# EAGLE schematic nRF_prog_vusb_3V3 (EAGLE 6.4)
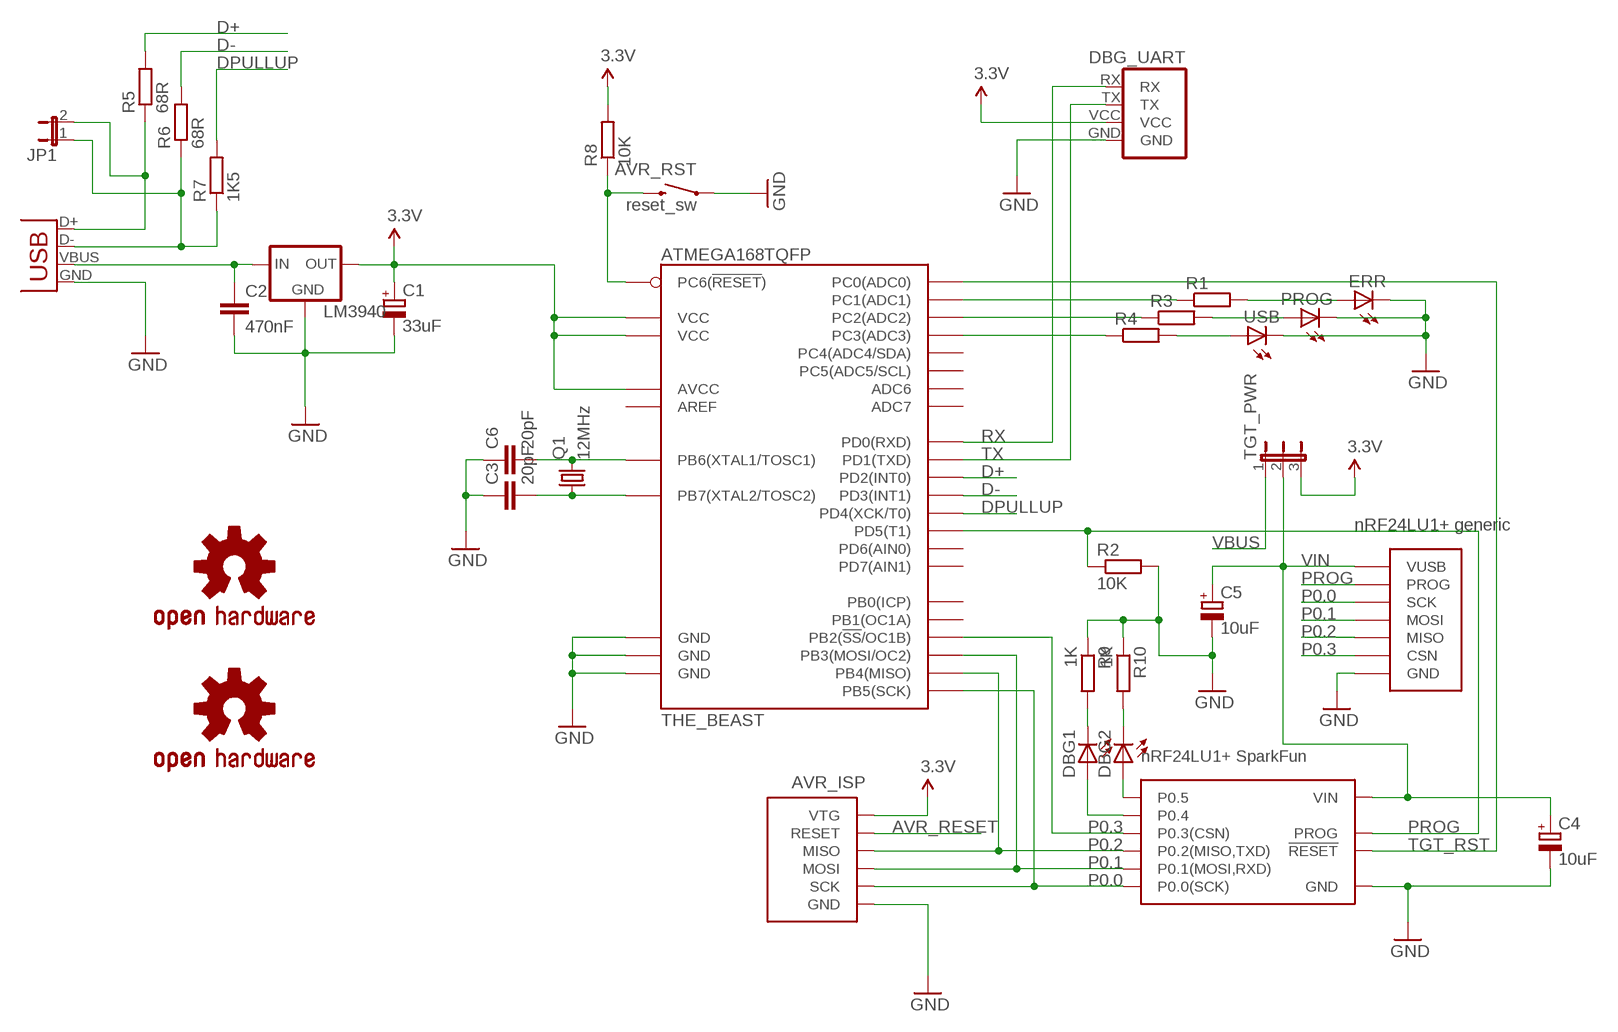
[diagram p0: schematic, sheet 1]

## Parts
AVR_ISP  AVR-ISP-6SMALL_FP  [AVR-ISP-6-SMALL-FP]
AVR_RST  reset_sw  SWITCH-MOMENTARY-2SMD  [TACTILE_SWITCH_SMD]
C1  33uF  CPOL-EUSMCB  [SMC_B]
C2  470nF  C-EUC0805K  [C0805K]
C3  20pF  C-EUC0805  [C0805]
C4  10uF  CPOL-EUSMCB  [SMC_B]
C5  10uF  CPOL-EUSMCB  [SMC_B]
C6  20pF  C-EUC0805  [C0805]
DBG1  LEDCHIPLED_0805  [CHIPLED_0805]
DBG2  LEDCHIPLED_0805  [CHIPLED_0805]
DBG_UART  UART_PORT  [UART_PORT]
ERR  LEDCHIPLED_0805  [CHIPLED_0805]
JP1  JP1E  [JP1]
LM3940  LM3940  [SOT223]
LU1+_GENERIC  NRF24LU1P_GENERIC  [NRF24LU1P_GENERIC]
LU1+_SPARKFUN  NRF24LU1P_SPARKFUN_BREAKOUT  [NRF24LU+_SPARKFUN_BREAKOUT]
PROG  LEDCHIPLED_0805  [CHIPLED_0805]
Q1  12MHz  CRYSTALHC49U-V  [QUARTZ]
R1  R-EU_M0805  [M0805]
R2  10K  R-EU_M0805  [M0805]
R3  R-EU_M0805  [M0805]
R4  R-EU_M0805  [M0805]
R5  68R  R-EU_M0805  [M0805]
R6  68R  R-EU_M0805  [M0805]
R7  1K5  R-EU_M0805  [M0805]
R8  10K  R-EU_M0805  [M0805]
R9  1K  R-EU_M0805  [M0805]
R10  1K  R-EU_M0805  [M0805]
TGT_PWR  JP2E  [JP2]
THE_BEAST  ATMEGA168TQFP  [TQFP32-08]
U$1  OSHW-LOGOM  [OSHW-LOGO-M]
U$2  OSHW-LOGOL  [OSHW-LOGO-L]
USB  LEDCHIPLED_0805  [CHIPLED_0805]
USB-B  USBPTH  [USB-B-PTH]

## Nets
3.3V: AVR_ISP.VCC(VTG) C1.+ DBG_UART.VCC LM3940.3(OUT) R8.2 TGT_PWR.3 THE_BEAST.4(VCC) THE_BEAST.6(VCC) THE_BEAST.18(AVCC)
AVR_RESET: AVR_ISP.RESET AVR_RST.3 R8.1 THE_BEAST.29(PC6(!RESET!))
D+: R5.2 THE_BEAST.32(PD2(INT0))
D-: R6.2 THE_BEAST.1(PD3(INT1))
DPULLUP: R7.2 THE_BEAST.2(PD4(XCK/T0))
GND: AVR_ISP.GND AVR_RST.1 C1.- C2.2 C3.1 C4.- C5.- C6.1 DBG_UART.GND ERR.C LM3940.2(GND) LM3940.4(GND) LU1+_GENERIC.GND LU1+_SPARKFUN.GND PROG.C R2.2 R9.1 R10.1 THE_BEAST.3(GND) THE_BEAST.5(GND) THE_BEAST.21(GND) USB-B.GND USB.C
N$1: DBG2.A LU1+_SPARKFUN.P0.5
N$2: DBG1.A LU1+_SPARKFUN.P0.4
N$3: DBG2.C R10.2
N$4: DBG1.C R9.2
N$8: R4.1 THE_BEAST.26(PC3(ADC3))
N$9: R3.1 THE_BEAST.25(PC2(ADC2))
N$13: R1.1 THE_BEAST.24(PC1(ADC1))
N$18: R4.2 USB.A
N$19: PROG.A R3.2
N$20: ERR.A R1.2
N$26: C6.2 Q1.2 THE_BEAST.7(PB6(XTAL1/TOSC1))
N$27: C3.2 Q1.1 THE_BEAST.8(PB7(XTAL2/TOSC2))
P0.0: AVR_ISP.SCK LU1+_GENERIC.SCK LU1+_SPARKFUN.P0.0(P0.0(SCK)) THE_BEAST.17(PB5(SCK))
P0.1: AVR_ISP.MOSI LU1+_GENERIC.MOSI LU1+_SPARKFUN.P0.1(P0.1(MOSI,RXD)) THE_BEAST.15(PB3(MOSI/OC2))
P0.2: AVR_ISP.MISO LU1+_GENERIC.MISO LU1+_SPARKFUN.P0.2(P0.2(MISO,TXD)) THE_BEAST.16(PB4(MISO))
P0.3: LU1+_GENERIC.CSN LU1+_SPARKFUN.P0.3(P0.3(CSN)) THE_BEAST.14(PB2(!SS!/OC1B))
PROG: LU1+_GENERIC.PROG LU1+_SPARKFUN.PROG R2.1 THE_BEAST.9(PD5(T1))
RX: DBG_UART.RX THE_BEAST.30(PD0(RXD))
TGT_RST: LU1+_SPARKFUN.RESET(!RESET!) THE_BEAST.23(PC0(ADC0))
TX: DBG_UART.TX THE_BEAST.31(PD1(TXD))
USB_D+: JP1.2 R5.1 USB-B.D+
USB_D-: JP1.1 R6.1 R7.1 USB-B.D-
VBUS: C2.1 LM3940.1(IN) TGT_PWR.1 USB-B.VBUS
VIN: C4.+ C5.+ LU1+_GENERIC.VUSB LU1+_SPARKFUN.VIN TGT_PWR.2
Unconnected: THE_BEAST.10(PD6(AIN0)) THE_BEAST.11(PD7(AIN1)) THE_BEAST.12(PB0(ICP)) THE_BEAST.13(PB1(OC1A)) THE_BEAST.19(ADC6) THE_BEAST.20(AREF) THE_BEAST.22(ADC7) THE_BEAST.27(PC4(ADC4/SDA)) THE_BEAST.28(PC5(ADC5/SCL))

## Library data of the parts
AVR_ISP = KileParts:AVR-ISP-6: AVR ISP-6 Serial Programming Header
AVR_RST = KileParts:SWITCH-MOMENTARY-2
C1 C4 C5 = rcl:CPOL-EU: POLARIZED CAPACITOR, European symbol
C2 C3 C6 = rcl:C-EU: CAPACITOR, European symbol
DBG1 DBG2 ERR PROG USB = led:LED: LED OSRAM: - CHIPLED LG R971, LG N971, LY N971, LG Q971, LY Q971, LO R971, LY R971 LH N974, LH R974 LS Q976, LO Q976, LY Q976 LO Q996 - Hyper CHIPLED LW Q18S LB Q993, LB Q99A, LB R99A - SideLED LS A670, LO A670, LY A670, LG A670, LP A670 LB A673, LV A673, LT A673, LW A673 LH A674 LY A675 LS A676, LA A676, LO A676, LY A676, LW A676 LS A679, LY A679, LG A679 - Hyper Micro SIDELED® LS Y876, LA Y876, LO Y876, LY Y876 LT Y87S - SmartLED LW L88C, LW L88S LB L89C, LB L89S, LG L890 LS L89K, LO L89K, LY L89K LS L896, LA L896, LO L896, LY L896 - TOPLED LS T670, LO T670, LY T670, LG T670, LP T670 LSG T670, LSP T670, LSY T670, LOP T670, LYG T670 LG T671, LOG T671, LSG T671 LB T673, LV T673, LT T673, LW T673 LH T674 LS T676, LA T676, LO T676, LY T676, LB T676, LH T676, LSB T676, LW T676 LB T67C, LV T67C, LT T67C, LS T67K, LO T67K, LY T67K, LW E67C LS E67B, LA E67B, LO E67B, LY E67B, LB E67C, LV E67C, LT E67C LW T67C LS T679, LY T679, LG T679 LS T770, LO T770, LY T770, LG T770, LP T770 LB T773, LV T773, LT T773, LW T773 LH T774 LS E675, LA E675, LY E675, LS T675 LS T776, LA T776, LO T776, LY T776, LB T776 LHGB T686 LT T68C, LB T68C - Hyper Mini TOPLED® LB M676 - Mini TOPLED Santana® LG M470 LS M47K, LO M47K, LY M47K Source: http://www.osram.convergy.de LUXEON: - LUMILED® LXK2-PW12-R00, LXK2-PW12-S00, LXK2-PW14-U00, LXK2-PW14-V00 LXK2-PM12-R00, LXK2-PM12-S00, LXK2-PM14-U00 LXK2-PE12-Q00, LXK2-PE12-R00, LXK2-PE12-S00, LXK2-PE14-T00, LXK2-PE14-U00 LXK2-PB12-K00, LXK2-PB12-L00, LXK2-PB12-M00, LXK2-PB14-N00, LXK2-PB14-P00, LXK2-PB14-Q00 LXK2-PR12-L00, LXK2-PR12-M00, LXK2-PR14-Q00, LXK2-PR14-R00 LXK2-PD12-Q00, LXK2-PD12-R00, LXK2-PD12-S00 LXK2-PH12-R00, LXK2-PH12-S00 LXK2-PL12-P00, LXK2-PL12-Q00, LXK2-PL12-R00 Source: www.luxeon.com KINGBRIGHT: KA-3528ASYC Source: www.kingbright.com
DBG_UART = KileParts:UART_PORT: PIN HEADER; OC_FARNELL: unknown; OC_NEWARK: unknown
JP1 = KileParts:JP1E: JUMPER
LM3940 = KileParts:LM3940: Low drop (max 0.4V at 500mA) 3.3V regulator - good for USB 5V to 3.3V
LU1+_GENERIC = KileParts:NRF24LU1P_GENERIC
LU1+_SPARKFUN = KileParts:NRF24LU1P_SPARKFUN_BREAKOUT
Q1 = KileParts:CRYSTAL: CRYSTAL; OC_FARNELL: 1666969; OC_NEWARK: unknown
R1-R10 = rcl:R-EU_: RESISTOR, European symbol
TGT_PWR = KileParts:JP2E: JUMPER
THE_BEAST = KileParts:ATMEGA168
U$1 U$2 = SparkFun:OSHW-LOGO: Open Source Hardware Logo This logo indicates the piece of hardware it is found on incorporates a OSHW license and/or adheres to the definition of open source hardware found here: http://freedomdefined.org/OSHW
USB-B = KileParts:USB: USB Connectors USB-B-PTH is fully proven SKU : PRT-00139 USB-miniB is fully proven SKU : PRT-00587 USB-A-PCB is untested. USB-A-H is throughly reviewed, but untested. Spark Fun Electronics SKU : PRT-00437 USB-B-SMT is throughly reviewed, but untested. Needs silkscreen touching up. USB-A-S has not been used/tested USB-MB-H has not been used/tested